# Altium schematic sheet Power.SchDoc: Power supply unit
size A4; Organization: Robocup Ulaval; DocumentNumber: 4; Revision: 1.0; SheetNumber: 4; SheetTotal: 10; Conceptor: Philippe T. Simon B. Léonard G. Alexia B-L.; Version: Gamma 1.0; PageSetup: Record=PageOptions|CenterHorizontal=True|CenterVertical=True|PrintScale=1.00|XCorrection=1.00|YCorrection=1.00|PrintKind=1|BorderSize=5000000|LeftOffset=0|BottomOffset=0|Orientation=2|PaperLength=1000|PaperWidth=1000|Scale=100|PaperSource=7|PrintQuality=-4|MediaType=1|DitherType=10|PaperKind=A4 Small|PrintScaleMode=1
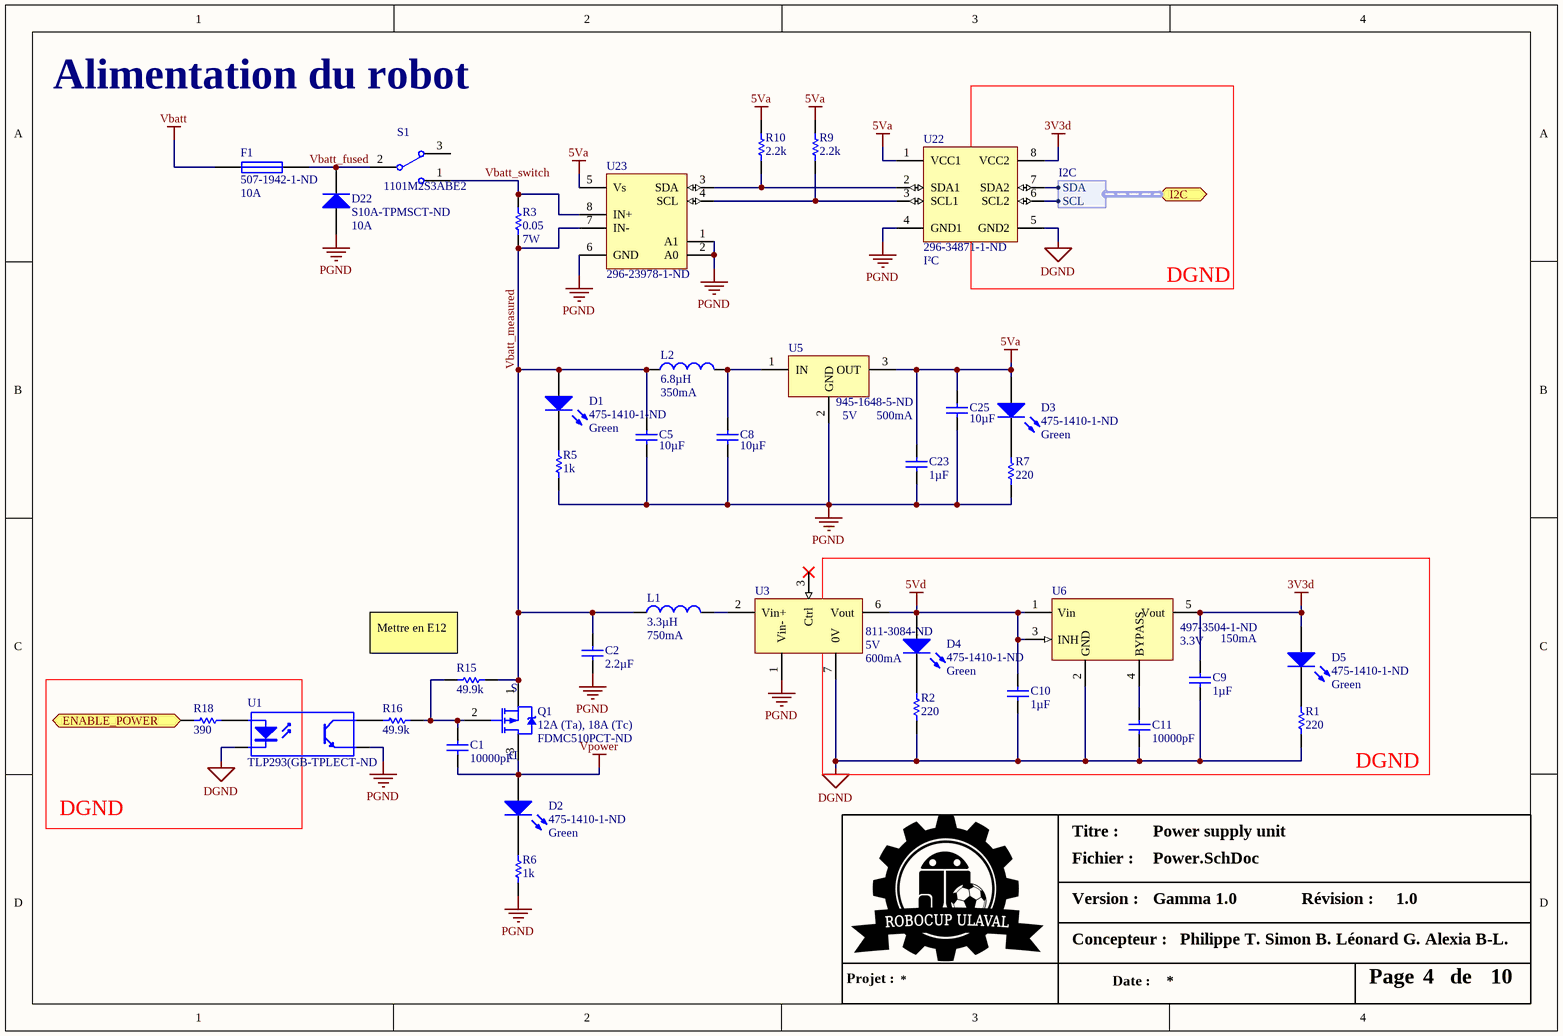
[diagram p0: Power.SchDoc]

## Parts
C1  Capacitance: 10000pF  [0603]  (hidden comment: GRM188R71H103KA01D)
C2  Capacitance: 2.2µF  [0805]  (hidden comment: CL21B225KAFNNWE)
C5  Capacitance: 10µF  [1206]  (hidden comment: GMK316AB7106KL-TR)
C8  Capacitance: 10µF  [1206]  (hidden comment: GMK316AB7106KL-TR)
C9  Capacitance: 1µF  [0805]  (hidden comment: CL21B105KBFNFNE)
C10  Capacitance: 1µF  [0805]  (hidden comment: CL21B105KBFNFNE)
C11  Capacitance: 10000pF  [0603]  (hidden comment: GRM188R71H103KA01D)
C23  Capacitance: 1µF  [0805]  (hidden comment: CL21B105KBFNFNE)
C25  Capacitance: 10µF  [1206]  (hidden comment: GMK316AB7106KL-TR)
D1  Supplier Part Number 1: 475-1410-1-ND  Color: Green  [0805]  (hidden comment: LG R971-KN-1)
D2  Supplier Part Number 1: 475-1410-1-ND  Color: Green  [0805]  (hidden comment: LG R971-KN-1)
D3  Supplier Part Number 1: 475-1410-1-ND  Color: Green  [0805]  (hidden comment: LG R971-KN-1)
D4  Supplier Part Number 1: 475-1410-1-ND  Color: Green  [0805]  (hidden comment: LG R971-KN-1)
D5  Supplier Part Number 1: 475-1410-1-ND  Color: Green  [0805]  (hidden comment: LG R971-KN-1)
D22  Supplier Part Number 1: S10A-TPMSCT-ND  Current - Average Rectified (Io): 10A  [SMC]  (hidden comment: S10A-TP)
F1  Supplier Part Number 1: 507-1942-1-ND  Current Rating: 10A  [1206]  (hidden comment: C1H 10)
L1  Inductance: 3.3µH  Current Rating: 750mA  [0805]  (hidden comment: MLZ2012N3R3LT000)
L2  Inductance: 6.8µH  Current Rating: 350mA  [0805]  (hidden comment: MLZ2012M6R8WT000)
Q1  Current - Continuous Drain (Id) @ 25°C: 12A (Ta), 18A (Tc)  Supplier Part Number 1: FDMC510PCT-ND  [PowerPAK 1212-8]  (hidden comment: FDMC510P)
R1  Resistance (Ohms): 220  [1206]  (hidden comment: RC1206JR-07220RL)
R2  Resistance (Ohms): 220  [1206]  (hidden comment: RC1206JR-07220RL)
R3  Resistance (Ohms): 0.05  Power (Watts): 7W  [RESC7146X15N]  (hidden comment: WSHM2818R0500FEA)
R5  Resistance (Ohms): 1k  [1206]  (hidden comment: RNCP1206FTD1K00)
R6  Resistance (Ohms): 1k  [1206]  (hidden comment: RC0603FR-072K2L)
R7  Resistance (Ohms): 220  [1206]  (hidden comment: RC1206JR-07220RL)
R9  Resistance (Ohms): 2.2k  [0603]  (hidden comment: RC0603FR-072K2L)
R10  Resistance (Ohms): 2.2k  [0603]  (hidden comment: RC0603FR-072K2L)
R15  Resistance (Ohms): 49.9k  [0603]  (hidden comment: RC0603FR-0749K9L)
R16  Resistance (Ohms): 49.9k  [0603]  (hidden comment: RC0603FR-0749K9L)
R18  Resistance (Ohms): 390  [0603]  (hidden comment: RC0603JR-07390RL)
S1  1101M2S3ABE2  [C&K Switch]
U1  Supplier Part Number 1: TLP293(GB-TPLECT-ND  [SOIC127P700X220-4N]  (hidden comment: TLP293(GB-TPL,E)
U3  Supplier Part Number 1: 811-3084-ND  Voltage - Output 1: 5V  Current - Output (Max): 600mA  [NCS3S]  (hidden comment: NCS3S1205SC)
U5  Supplier Part Number 1: 945-1648-5-ND  Voltage - Output 1: 5V  Current - Output (Max): 500mA  [3-SIP MOdule]  (hidden comment: R-78E5.0-0.5)
U6  Supplier Part Number 1: 497-3504-1-ND  Voltage - Output: 3.3V  Current - Output: 150mA  [SOT-23-5]  (hidden comment: LD3985M33R)
U22  Supplier Part Number 1: 296-34871-1-ND  Type: I²C  [SOIC127P600X175-8N]  (hidden comment: ISO1540DR)
U23  Supplier Part Number 1: 296-23978-1-ND  [SOIC127P600X175-8N]  (hidden comment: INA219AIDR)

## Blocks framed on the sheet
DGND: U22
DGND: C9-C11 D4 D5 R1 R2 U6
DGND: R18

## Ports
ENABLE_POWER (in), I2C (harness I2C)

## Harnesses
I2C: SCL, SDA

## Nets
3V3d: C9.2 D5.1(A) U6.5(Vout) U22.8(VCC2)
5Va: C23.2 C25.2 D3.1(A) R9.2 R10.2 U5.3(OUT) U22.1(VCC1) U23.5(Vs)
5Vd: C10.2 D4.1(A) U3.6(Vout) U6.1(Vin) U6.3(INH)
DGND: C9.1 C10.1 C11.1 R1.1 R2.1 U1.2(K) U3.7(0V) U6.2(GND) U22.5(GND2)
PGND: C2.1 C5.1 C8.1 C23.1 C25.1 D22.1(A) R5.1 R6.1 R7.1 U1.3(E) U3.1(Vin-) U5.2(GND) U22.4(GND1) U23.1(A1) U23.2(A0) U23.6(GND)
Vbatt: F1.1
Vpower: C1.1 D2.1(A) Q1.3(D)
ENABLE_POWER: R18.1 ; port ENABLE_POWER
Vbatt_fused: D22.2(K) F1.2 S1.2
Vbatt_measured: C2.2 C5.2 D1.1(A) L1.1 L2.1 Q1.1(S) R3.1 R15.2 U23.7(IN-)
Vbatt_switch: R3.2 S1.1 U23.8(IN+)
NetC1_2: C1.2 Q1.2(G) R15.1 R16.2
NetC8_2: C8.2 L2.2 U5.1(IN)
NetC11_2: C11.2 U6.4(BYPASS)
NetD1_2: D1.2(K) R5.2
NetD2_2: D2.2(K) R6.2
NetD3_2: D3.2(K) R7.2
NetD4_2: D4.2(K) R2.2
NetD5_2: D5.2(K) R1.2
NetL1_2: L1.2 U3.2(Vin+)
NetR9_1: R9.1 U22.3(SCL1) U23.4(SCL)
NetR10_1: R10.1 U22.2(SDA1) U23.3(SDA)
NetR16_1: R16.1 U1.4(C)
NetR18_2: R18.2 U1.1(A)
NetU22_6: U22.6(SCL2) ; port I2C.SCL
NetU22_7: U22.7(SDA2) ; port I2C.SDA

Not connected (* = marked no-connect by the designer): S1 3; U3 3(Ctrl)*

## Notes on the sheet
- Alimentation du robot
- (near R15) Mettre en E12
- Titre :
- Version :
- Fichier :
- Révision :
- Projet :
- Concepteur :
- Date :
- Page
- de

## Library data of the parts
C1 C11 = GRM188R71H103KA01D: CAP CER 10000PF 50V X7R 0603; Manufacturer: Murata Electronics North America; Tolerance: ±10%; Supplier 1: Digi-Key; Manufacturer Part Number: GRM188R71H103KA01D; RoHS: RoHS Compliant; Category: Capacitors; Stock 1: 3064909; Pricing 1: 1=0.14, 10=0.027, 50=0.0142, 100=0.0121, 250=0.00988, 500=0.00848, 1000=0.00661 (CAD); Packaging: Cut Tape (CT); Voltage - Rated: 50V; Temperature Coefficient: X7R; Mounting Type: Surface Mount, MLCC; Operating Temperature: -55°C ~ 125°C; Applications: General Purpose; Ratings: -; Package / Case: 0603 (1608 Metric); Size / Dimension: 0.063" L x 0.031" W (1.60mm x 0.80mm); Height - Seated (Max): -; Thickness (Max): 0.035" (0.90mm); Lead Spacing: -; Features: -; Lead Style: -; ComponentLink1URL: http://www.murata.com/~/media/webrenewal/support/library/catalog/products/capacitor/mlcc/c02e.pdf; ComponentLink1Description: http://www.murata.com/~/media/webrenewal/support/library/catalog/products/capacitor/mlcc/c02e.pdf; Supplier Part Number 1: 490-1512-1-ND
C2 = CL21B225KAFNNWE: CAP CER 2.2UF 25V X7R 0805; Manufacturer: Samsung Electro-Mechanics America, Inc.; Tolerance: ±10%; Supplier 1: Digi-Key; Supplier Part Number 1: 1276-2955-1-ND; Manufacturer Part Number: CL21B225KAFNNWE; RoHS: RoHS Compliant; Category: Capacitors; Stock 1: 66081; Pricing 1: 1=0.3, 10=0.199, 25=0.1452, 50=0.1208, 100=0.1015, 500=0.07252, 1000=0.06163 (CAD); Packaging: Cut Tape (CT); Voltage - Rated: 25V; Temperature Coefficient: X7R; Mounting Type: Surface Mount, MLCC; Operating Temperature: -55°C ~ 125°C; Applications: General Purpose; Ratings: -; Package / Case: 0805 (2012 Metric); Size / Dimension: 0.079" L x 0.049" W (2.00mm x 1.25mm); Height - Seated (Max): -; Thickness (Max): 0.053" (1.35mm); Lead Spacing: -; Features: -; Lead Style: -; ComponentLink1URL: http://media.digikey.com/pdf/Data%20Sheets/Samsung%20PDFs/CL21B225KAFNNWE_Spec.pdf; ComponentLink1Description: http://media.digikey.com/pdf/Data%20Sheets/Samsung%20PDFs/CL21B225KAFNNWE_Spec.pdf
C5 C8 C25 = GMK316AB7106KL-TR: CAP CER 10UF 35V X7R 1206; Manufacturer: Taiyo Yuden; Tolerance: ±10%; Supplier 1: Digi-Key; Supplier Part Number 1: 587-3007-1-ND; Manufacturer Part Number: GMK316AB7106KL-TR; RoHS: RoHS Compliant; Category: Capacitors; Stock 1: 108706; Pricing 1: 1=0.84, 10=0.697, 50=0.4996, 100=0.4371, 250=0.34344, 500=0.31222, 1000=0.24978 (CAD); Packaging: Cut Tape (CT); Voltage - Rated: 35V; Temperature Coefficient: X7R; Mounting Type: Surface Mount, MLCC; Operating Temperature: -55°C ~ 125°C; Applications: General Purpose; Ratings: -; Package / Case: 1206 (3216 Metric); Size / Dimension: 0.126" L x 0.063" W (3.20mm x 1.60mm); Height - Seated (Max): -; Thickness (Max): 0.071" (1.80mm); Lead Spacing: -; Features: -; Lead Style: -; ComponentLink1URL: http://media.digikey.com/pdf/Data%20Sheets/Taiyo%20Yuden%20PDFs%20URL%20links/GMK316AB7106KL-TR_ProdSpec.pdf; ComponentLink1Description: http://media.digikey.com/pdf/Data%20Sheets/Taiyo%20Yuden%20PDFs%20URL%20links/GMK316AB7106KL-TR_ProdSpec.pdf
C9 C10 C23 = CL21B105KBFNFNE: CAP CER 1UF 50V X7R 0805; Manufacturer: Samsung Electro-Mechanics America, Inc.; Tolerance: ±10%; Supplier 1: Digi-Key; Manufacturer Part Number: CL21B105KBFNFNE; RoHS: RoHS Compliant; Stock 1: 21699; Pricing 1: 1=0.27, 10=0.186, 25=0.14, 50=0.1072, 100=0.0884, 500=0.06238, 1000=0.05123 (CAD); Packaging: Cut Tape (CT); Voltage - Rated: 50V; Temperature Coefficient: X7R; Mounting Type: Surface Mount, MLCC; Operating Temperature: -55°C ~ 125°C; Applications: General Purpose; Ratings: -; Package / Case: 0805 (2012 Metric); Size / Dimension: 0.079" L x 0.049" W (2.00mm x 1.25mm); Height - Seated (Max): -; Thickness (Max): 0.053" (1.35mm); Lead Spacing: -; Features: -; Lead Style: -; ComponentLink1URL: http://www.samsungsem.com/kr/support/product-search/mlcc/CL21B105KBFNFNE.jsp; ComponentLink1Description: http://www.samsungsem.com/kr/support/product-search/mlcc/CL21B105KBFNFNE.jsp; Supplier Part Number 1: 1276-2928-1-ND; Category: Capacitors
D1-D5 = LG R971-KN-1: LED GREEN DIFFUSED 0805 SMD; Manufacturer: OSRAM Opto Semiconductors Inc.; Lens Color: White; Millicandela Rating: 26.05mcd; Lens Style/Size: Rectangle with Flat Top, 1.30mm x 1.25mm; Voltage - Forward (Vf) (Typ): 2.2V; Current - Test: 20mA; Viewing Angle: 160°; Wavelength - Dominant: 570nm; Wavelength - Peak: 572nm; Supplier 1: Digi-Key; Manufacturer Part Number: LG R971-KN-1; RoHS: RoHS Compliant; Category: Optoelectronics; Stock 1: 315869; Pricing 1: 1=0.37, 10=0.267, 25=0.1972, 100=0.141, 250=0.09588, 500=0.0846, 1000=0.06626 (CAD); Packaging: Cut Tape (CT); Lens Transparency: Diffused; Mounting Type: Surface Mount; Features: -; Package / Case: 0805 (2012 Metric); Supplier Device Package: *; Size / Dimension: 2.00mm L x 1.25mm W; Height (Max): 0.90mm; ComponentLink1URL: http://www.osram-os.com/Graphics/XPic9/00078860_0.pdf; ComponentLink1Description: http://www.osram-os.com/Graphics/XPic9/00078860_0.pdf
D22 = S10A-TP: DIODE GEN PURP 50V 10A DO214AB; Manufacturer: Micro Commercial Co; Diode Type: Standard; Voltage - Forward (Vf) (Max) @ If: 1.2V @ 10A; Speed: Standard Recovery >500ns, > 200mA (Io); Current - Reverse Leakage @ Vr: 10µA @ 50V; Supplier 1: Digi-Key; Manufacturer Part Number: S10A-TP; RoHS: RoHS Compliant; Category: Discrete Semiconductor Products; Stock 1: 16594; Pricing 1: 1=0.88, 10=0.769, 25=0.6808, 100=0.5932, 250=0.51624, 500=0.43934 (CAD); Packaging: Cut Tape (CT); Voltage - DC Reverse (Vr) (Max): 50V; Reverse Recovery Time (trr): -; Capacitance @ Vr, F: -; Mounting Type: Surface Mount; Package / Case: DO-214AB, SMC; Supplier Device Package: DO-214AB, (SMC); Operating Temperature - Junction: -55°C ~ 150°C; ComponentLink1URL: http://www.mccsemi.com/up_pdf/S10A~S10M(HSMC).PDF; ComponentLink1Description: http://www.mccsemi.com/up_pdf/S10A~S10M(HSMC).PDF
F1 = C1H 10: FUSE BOARD MNT 10A 125VAC 32VDC; Manufacturer: Bel Fuse Inc.; Fuse Type: Board Mount (Cartridge Style Excluded); Voltage Rating - AC: 125V; Voltage Rating - DC: 32V; Response Time: Fast; Breaking Capacity @ Rated Voltage: 150A; Melting I²t: 5.9; Approvals: cURus; DC Cold Resistance: 0.0039 Ohm; Supplier 1: Digi-Key; Manufacturer Part Number: C1H 10; RoHS: RoHS Compliant; Category: Circuit Protection; Stock 1: 8694; Pricing 1: 1=0.47, 10=0.438, 25=0.4036, 100=0.363, 250=0.3232, 500=0.26932, 1000=0.25521, 2500=0.22828 (CAD); Packaging: Cut Tape (CT); Package / Case: 1206 (3216 Metric); Mounting Type: Surface Mount; Operating Temperature: -55°C ~ 125°C; Color: -; Size / Dimension: 0.126" L x 0.062" W x 0.026" H (3.20mm x 1.58mm x 0.65mm); ComponentLink1URL: http://belfuse.com/pdfs/C1H.pdf; ComponentLink1Description: http://belfuse.com/pdfs/C1H.pdf
L1 = MLZ2012N3R3LT000: FIXED IND 3.3UH 750MA 150 MOHM; Manufacturer: TDK Corporation; Type: Multilayer; Material - Core: Ferrite; Tolerance: ±20%; Current - Saturation: 130mA; Shielding: Shielded; DC Resistance (DCR): 195 mOhm Max; Frequency - Self Resonant: 90MHz; Frequency - Test: 2MHz; Supplier 1: Digi-Key; Supplier Part Number 1: 445-6759-1-ND; Manufacturer Part Number: MLZ2012N3R3LT000; RoHS: RoHS Compliant; Category: Inductors, Coils, Chokes; Stock 1: 9368; Pricing 1: 1=0.21, 10=0.189, 50=0.1478, 100=0.1325, 500=0.11356, 1000=0.09841 (CAD); Packaging: Cut Tape (CT); Q @ Freq: -; Ratings: -; Operating Temperature: -55°C ~ 125°C; Mounting Type: Surface Mount; Package / Case: 0805 (2012 Metric); Size / Dimension: 0.079" L x 0.049" W (2.00mm x 1.25mm); Height - Seated (Max): 0.041" (1.05mm); ComponentLink1URL: https://product.tdk.com/info/en/catalog/datasheets/inductor_commercial_decoupling_mlz2012_en.pdf; ComponentLink1Description: https://product.tdk.com/info/en/catalog/datasheets/inductor_commercial_decoupling_mlz2012_en.pdf
L2 = MLZ2012M6R8WT000: FIXED IND 6.8UH 350MA 400 MOHM; Manufacturer: TDK Corporation; Type: Multilayer; Material - Core: Ferrite; Tolerance: ±20%; Current - Saturation: 220mA; Shielding: Shielded; DC Resistance (DCR): 520 mOhm Max; Frequency - Test: 2MHz; Supplier 1: Digi-Key; Supplier Part Number 1: 445-6402-1-ND; Manufacturer Part Number: MLZ2012M6R8WT000; RoHS: RoHS Compliant; Category: Inductors, Coils, Chokes; Packaging: Tape & Reel (TR); Q @ Freq: -; Frequency - Self Resonant: -; Ratings: -; Operating Temperature: -55°C ~ 125°C; Mounting Type: Surface Mount; Package / Case: 0805 (2012 Metric); Size / Dimension: 0.079" L x 0.049" W (2.00mm x 1.25mm); Height - Seated (Max): 0.057" (1.45mm); ComponentLink1URL: https://product.tdk.com/info/en/catalog/datasheets/inductor_commercial_decoupling_mlz2012_en.pdf; ComponentLink1Description: https://product.tdk.com/info/en/catalog/datasheets/inductor_commercial_decoupling_mlz2012_en.pdf
Q1 = FDMC510P: MOSFET P-CH 20V 18A 8-MLP; Manufacturer: Fairchild Semiconductor; FET Type: MOSFET P-Channel, Metal Oxide; FET Feature: Standard; Rds On (Max) @ Id, Vgs: 8 mOhm @ 12A, 4.5V; Vgs(th) (Max) @ Id: 1V @ 250µA; Gate Charge (Qg) @ Vgs: 116nC @ 4.5V; Input Capacitance (Ciss) @ Vds: 7860pF @ 10V; Power - Max: 2.3W; Supplier 1: Digi-Key; Manufacturer Part Number: FDMC510P; RoHS: RoHS Compliant; Category: Discrete Semiconductor Products; Stock 1: 32424; Pricing 1: 1=2.03, 10=1.816, 100=1.4153, 500=1.17042, 1000=0.92559 (CAD); Packaging: Cut Tape (CT); Drain to Source Voltage (Vdss): 20V; Operating Temperature: -55°C ~ 150°C (TJ); Mounting Type: Surface Mount; Package / Case: 8-PowerWDFN; Supplier Device Package: 8-MLP (3.3x3.3); ComponentLink1URL: http://www.fairchildsemi.com/datasheets/FD/FDMC510P.pdf; ComponentLink1Description: http://www.fairchildsemi.com/datasheets/FD/FDMC510P.pdf
R1 R2 R7 = RC1206JR-07220RL: RES SMD 220 OHM 5% 1/4W 1206; Manufacturer: Yageo; Power (Watts): 0.25W, 1/4W; Temperature Coefficient: ±100ppm/°C; Supplier 1: Digi-Key; Manufacturer Part Number: RC1206JR-07220RL; RoHS: RoHS Compliant; Category: Resistors; Stock 1: 224548; Pricing 1: 1=0.15, 10=0.036, 25=0.0268, 100=0.015, 250=0.0114, 500=0.00912, 1000=0.00671, 2500=0.00582 (CAD); Packaging: Cut Tape (CT); Tolerance: ±5%; Composition: Thick Film; Features: Moisture Resistant; Operating Temperature: -55°C ~ 155°C; Package / Case: 1206 (3216 Metric); Supplier Device Package: 1206; Size / Dimension: 0.122" L x 0.063" W (3.10mm x 1.60mm); Height: 0.026" (0.65mm); Number of Terminations: 2; ComponentLink1URL: http://www.yageo.com/documents/recent/PYu-RC_Group_51_RoHS_L_04.pdf; ComponentLink1Description: http://www.yageo.com/documents/recent/PYu-RC_Group_51_RoHS_L_04.pdf; Supplier Part Number 1: 311-220ERCT-ND
R3 = WSHM2818R0500FEA: RES SMD 0.05 OHM 1% 7W 2818; Manufacturer: Vishay Dale; Temperature Coefficient: ±75ppm/°C; Supplier 1: Digi-Key; Supplier Part Number 1: 541-2633-1-ND; Manufacturer Part Number: WSHM2818R0500FEA; RoHS: RoHS Compliant; Category: Resistors; Stock 1: 1975; Pricing 1: 1=2.04, 10=1.808, 25=1.6612, 50=1.5156, 100=1.3116, 250=1.10756, 500=0.93264, 1000=0.77526 (CAD); Packaging: Cut Tape (CT); Tolerance: ±1%; Composition: Metal Element; Features: Automotive AEC-Q200, Current Sense, Moisture Resistant, Pulse Withstanding; Operating Temperature: -65°C ~ 170°C; Package / Case: 2818; Supplier Device Package: 2818; Size / Dimension: 0.280" L x 0.181" W (7.10mm x 4.60mm); Height: 0.069" (1.75mm); Number of Terminations: 2; ComponentLink1URL: http://www.vishay.com/docs/30188/wshm2818.pdf; ComponentLink1Description: http://www.vishay.com/docs/30188/wshm2818.pdf
R5 R6 = RNCP1206FTD1K00: RES SMD 1K OHM 1% 1/2W 1206; Manufacturer: Stackpole Electronics Inc.; Temperature Coefficient: ±100ppm/°C; Power (Watts): 0.5W, 1/2W; Supplier 1: Digi-Key; Manufacturer Part Number: RNCP1206FTD1K00; RoHS: RoHS Compliant; Category: Resistors; Stock 1: 13665; Pricing 1: 1=0.15, 10=0.074, 50=0.041, 100=0.0302, 250=0.02312, 500=0.01848, 1000=0.0136, 2500=0.0118 (CAD); Packaging: Cut Tape (CT); Part Status: Active; Tolerance: ±1%; Composition: Thin Film; Features: Anti-Sulfur, Moisture Resistant; Operating Temperature: -55°C ~ 155°C; Package / Case: 1206 (3216 Metric); Supplier Device Package: 1206; Size / Dimension: 0.122" L x 0.059" W (3.10mm x 1.50mm); Height: 0.024" (0.60mm); Number of Terminations: 2; Failure Rate: -; ComponentLink1URL: http://www.seielect.com/catalog/SEI-RNCP.pdf; ComponentLink1Description: http://www.seielect.com/catalog/SEI-RNCP.pdf; Supplier Part Number 1: RNCP1206FTD1K00CT-ND
R9 R10 = RC0603FR-072K2L: RES SMD 2.2K OHM 1% 1/10W 0603; Manufacturer: Yageo; Power (Watts): 0.1W, 1/10W; Temperature Coefficient: ±100ppm/°C; Supplier 1: Digi-Key; Manufacturer Part Number: RC0603FR-072K2L; RoHS: RoHS Compliant; Category: Resistors; Stock 1: 297758; Pricing 1: 1=0.15, 10=0.021, 25=0.0152, 100=0.0086, 250=0.0066, 500=0.00526, 1000=0.00389, 2500=0.00337 (CAD); Packaging: Cut Tape (CT); Tolerance: ±1%; Composition: Thick Film; Features: Moisture Resistant; Operating Temperature: -55°C ~ 155°C; Package / Case: 0603 (1608 Metric); Supplier Device Package: 0603; Size / Dimension: 0.063" L x 0.031" W (1.60mm x 0.80mm); Height: 0.022" (0.55mm); Number of Terminations: 2; ComponentLink1URL: http://www.yageo.com/documents/recent/PYu-RC_Group_51_RoHS_L_04.pdf; ComponentLink1Description: http://www.yageo.com/documents/recent/PYu-RC_Group_51_RoHS_L_04.pdf; Supplier Part Number 1: 311-2.20KHRCT-ND
R15 R16 = RC0603FR-0749K9L: RES SMD 49.9K OHM 1% 1/10W 0603; Manufacturer: Yageo; Power (Watts): 0.1W, 1/10W; Temperature Coefficient: ±100ppm/°C; Supplier 1: Digi-Key; Manufacturer Part Number: RC0603FR-0749K9L; RoHS: RoHS Compliant; Category: Resistors; Stock 1: 1514497; Pricing 1: 1=0.15, 10=0.021, 25=0.0152, 100=0.0086, 250=0.0066, 500=0.00526, 1000=0.00389, 2500=0.00337 (CAD); Packaging: Cut Tape (CT); Tolerance: ±1%; Composition: Thick Film; Features: Moisture Resistant; Operating Temperature: -55°C ~ 155°C; Package / Case: 0603 (1608 Metric); Supplier Device Package: 0603; Size / Dimension: 0.063" L x 0.031" W (1.60mm x 0.80mm); Height: 0.022" (0.55mm); Number of Terminations: 2; ComponentLink1URL: http://www.yageo.com/documents/recent/PYu-RC_Group_51_RoHS_L_04.pdf; ComponentLink1Description: http://www.yageo.com/documents/recent/PYu-RC_Group_51_RoHS_L_04.pdf; Supplier Part Number 1: 311-49.9KHRCT-ND
R18 = RC0603JR-07390RL: RES SMD 390 OHM 5% 1/10W 0603; Manufacturer: Yageo; Power (Watts): 0.1W, 1/10W; Temperature Coefficient: ±100ppm/°C; Supplier 1: Digi-Key; Manufacturer Part Number: RC0603JR-07390RL; RoHS: RoHS Compliant; Category: Resistors; Stock 1: 718727; Pricing 1: 1=0.15, 10=0.017, 25=0.012, 100=0.0067, 250=0.00508, 500=0.00408, 1000=0.003, 2500=0.0026 (CAD); Packaging: Cut Tape (CT); Tolerance: ±5%; Composition: Thick Film; Features: Moisture Resistant; Operating Temperature: -55°C ~ 155°C; Package / Case: 0603 (1608 Metric); Supplier Device Package: 0603; Size / Dimension: 0.063" L x 0.031" W (1.60mm x 0.80mm); Height: 0.022" (0.55mm); Number of Terminations: 2; ComponentLink1URL: http://www.yageo.com/documents/recent/PYu-RC_Group_51_RoHS_L_04.pdf; ComponentLink1Description: http://www.yageo.com/documents/recent/PYu-RC_Group_51_RoHS_L_04.pdf; Supplier Part Number 1: 311-390GRCT-ND
S1 = 1101M2S3ABE2: SWITCH SLIDE SPDT 0.4VA 20V; Manufacturer: C&K Components; Contact Timing: Not Specified; Switch Function: On-On; Current Rating: 0.4VA (AC/DC); Actuator Type: Standard; Actuator Length: 4.72mm; Actuator Material: Polyamide (PA), Nylon; Switch Travel: 2.16mm; Electrical Life: 100,000 Cycles; Supplier 1: Digi-Key; Manufacturer Part Number: 1101M2S3ABE2; RoHS: RoHS Compliant; Category: Switches; Stock 1: 1611; Pricing 1: 1=6.09, 10=5.952, 25=5.6872, 50=5.026, 100=4.9598, 250=4.89372, 500=4.034, 1000=3.76947, 5000=3.51818 (CAD); Packaging: Bulk; Part Status: Active; Circuit: SPDT; Voltage Rating - AC: 20V; Voltage Rating - DC: 20V; Contact Material: Copper; Contact Finish: Gold; Mounting Type: Through Hole, Right Angle; Termination Style: PC Pin; Features: Black Actuator, Epoxy Sealed Terminals; Operating Temperature: -30°C ~ 65°C; Mechanical Life: -; Operating Force: -; ComponentLink1URL: http://www.ck-components.com/media/1429/1000.pdf; ComponentLink1Description: http://www.ck-components.com/media/1429/1000.pdf; Supplier Part Number 1: CKN5005-ND
U1 = TLP293(GB-TPL,E: OPTOISOLATOR 3.75KV TRANS 4-SO; Manufacturer: Toshiba Semiconductor and Storage; Number of Channels: 1; Voltage - Isolation: 3750Vrms; Current Transfer Ratio (Min): 100% @ 5mA; Current Transfer Ratio (Max): 600% @ 5mA; Turn On / Turn Off Time (Typ): 3µs, 3µs; Rise / Fall Time (Typ): 2µs, 3µs; Input Type: DC; Output Type: Transistor; Voltage - Output (Max): 80V; Current - Output / Channel: 50mA; Voltage - Forward (Vf) (Typ): 1.25V; Vce Saturation (Max): 300mV; Supplier 1: Digi-Key; Manufacturer Part Number: TLP293(GB-TPL,E; RoHS: RoHS Compliant; Category: Isolators; Stock 1: 34284; Pricing 1: 1=0.74, 10=0.536, 25=0.438, 100=0.3503, 250=0.29564, 500=0.2518, 1000=0.19706 (CAD); Packaging: Cut Tape (CT); Current - DC Forward (If) (Max): 50mA; Operating Temperature: -55°C ~ 125°C; Mounting Type: Surface Mount; Package / Case: 4-SOIC (0.179", 4.55mm); Supplier Device Package: 4-SO; ComponentLink1URL: https://toshiba.semicon-storage.com/info/docget.jsp?did=14419&prodName=TLP293; ComponentLink1Description: https://toshiba.semicon-storage.com/info/docget.jsp?did=14419&prodName=TLP293
U3 = NCS3S1205SC: DC/DC CONVERTER 5V 3W; Manufacturer: Murata Power Solutions Inc.; Number of Outputs: 1; Voltage - Input (Min): 9V; Voltage - Input (Max): 36V; Voltage - Isolation: 1.5kV (1500V); Efficiency: 82%; Supplier 1: Digi-Key; Manufacturer Part Number: NCS3S1205SC; RoHS: RoHS Compliant; Category: Power Supplies - Board Mount; Stock 1: 0; Pricing 1: 1=15.64, 5=15.568, 10=15.455, 25=15.2844, 50=14.9004, 100=14.1611, 250=13.2512, 500=12.35548, 1000=12.29145 (CAD); Packaging: Tube; Type: Isolated Module; Voltage - Output 2: -; Voltage - Output 3: -; Power (Watts) - Manufacture Series: 3W; Applications: ITE (Commercial); Features: SCP; Mounting Type: Through Hole; Package / Case: 8-DIP Module (6 Leads); Size / Dimension: 0.86" L x 0.37" W x 0.44" H (22.0mm x 9.5mm x 11.3mm); Operating Temperature: -40°C ~ 85°C; Power (Watts) - Max: 3W; ComponentLink1URL: http://power.murata.com/data/power/ncl/kdc_ncs3.pdf; ComponentLink1Description: http://power.murata.com/data/power/ncl/kdc_ncs3.pdf
U5 = R-78E5.0-0.5: CONV DC/DC 5V 500MA OUT THRU; Manufacturer: Recom Power; Power (Watts) - Manufacture Series: 3W; Number of Outputs: 1; Voltage - Input (Min): 7V; Voltage - Input (Max): 28V; Efficiency: 92%; Supplier 1: Digi-Key; Manufacturer Part Number: R-78E5.0-0.5; RoHS: RoHS Compliant; Category: Power Supplies - Board Mount; Stock 1: 5464; Pricing 1: 1=4.04, 5=3.972, 10=3.916, 50=3.6854, 100=3.5701, 250=3.45496 (CAD); Packaging: Tube; Type: Linear Regulator Replacement; Voltage - Output 2: -; Voltage - Output 3: -; Voltage - Isolation: -; Applications: ITE (Commercial); Features: -; Mounting Type: Through Hole; Package / Case: 3-SIP Module; Size / Dimension: 0.46" L x 0.33" W x 0.41" H (11.6mm x 8.5mm x 10.4mm); Operating Temperature: -40°C ~ 85°C; Power (Watts) - Max: 3W; ComponentLink1URL: http://www.recom-power.com/pdf/Innoline/R-78Exx-0.5.pdf; ComponentLink1Description: http://www.recom-power.com/pdf/Innoline/R-78Exx-0.5.pdf
U6 = LD3985M33R: IC REG LDO 3.3V 0.15A SOT23-5; Manufacturer: STMicroelectronics; Regulator Topology: Positive Fixed; Voltage - Dropout (Typical): 0.06V @ 150mA; Number of Regulators: 1; Voltage - Input: Up to 6V; Current - Limit (Min): 300mA; Supplier 1: Digi-Key; Manufacturer Part Number: LD3985M33R; RoHS: RoHS Compliant; Category: Integrated Circuits (ICs); Stock 1: 6080; Pricing 1: 1=0.95, 10=0.815, 100=0.6081, 500=0.47766, 1000=0.36825 (CAD); Packaging: Cut Tape (CT); Operating Temperature: -40°C ~ 125°C; Mounting Type: Surface Mount; Package / Case: SC-74A, SOT-753; Supplier Device Package: SOT-23-5; ComponentLink1URL: http://www.st.com/web/en/resource/technical/document/datasheet/CD00003395.pdf; ComponentLink1Description: http://www.st.com/web/en/resource/technical/document/datasheet/CD00003395.pdf
U22 = ISO1540DR: DGTL ISO 2.5KV 2CH I2C 8SOIC; Manufacturer: Texas Instruments; Isolated Power: No; Number of Channels: 2; Inputs - Side 1/Side 2: 2/2; Channel Type: Bidirectional; Voltage - Isolation: 2500Vrms; Common Mode Transient Immunity (Min): 25kV/µs; Data Rate: 1Mbps; Pulse Width Distortion (Max): 80ns, 21ns; Voltage - Supply: 3 V ~ 5.5 V; Supplier 1: Digi-Key; Manufacturer Part Number: ISO1540DR; RoHS: RoHS Compliant; Category: Isolators; Stock 1: 4991; Pricing 1: 1=6.98, 10=6.27, 100=5.1441, 500=4.3763, 1000=3.19905 (CAD); Packaging: Cut Tape (CT); Technology: Capacitive Coupling; Propagation Delay tpLH / tpHL (Max): -; Rise / Fall Time (Typ): -; Operating Temperature: -40°C ~ 125°C; Package / Case: 8-SOIC (0.154", 3.90mm Width); Supplier Device Package: 8-SOIC; ComponentLink1URL: http://www.ti.com/lit/ds/symlink/iso1540.pdf; ComponentLink1Description: http://www.ti.com/lit/ds/symlink/iso1540.pdf
U23 = INA219AIDR: IC CURRENT MONITOR 1% 8SOIC; Manufacturer: Texas Instruments; Sensing Method: High-Side; Voltage - Input: 0 V ~ 26 V; Current - Output: 10mA; Supplier 1: Digi-Key; Manufacturer Part Number: INA219AIDR; RoHS: RoHS Compliant; Category: Integrated Circuits (ICs); Stock 1: 4871; Pricing 1: 1=3.11, 10=2.795, 100=2.2419, 500=1.84266, 1000=1.27962 (CAD); Packaging: Cut Tape (CT); Function: Current Monitor; Accuracy: ±1%; Operating Temperature: -40°C ~ 125°C; Mounting Type: Surface Mount; Package / Case: 8-SOIC (0.154", 3.90mm Width); Supplier Device Package: 8-SOIC; ComponentLink1URL: http://www.ti.com/lit/ds/symlink/ina219.pdf; ComponentLink1Description: http://www.ti.com/lit/ds/symlink/ina219.pdf